# EAGLE design button_arduino (EAGLE 8.7.0)
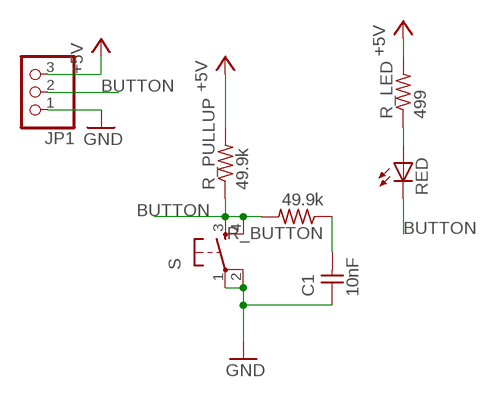
[diagram p0: schematic, sheet 1]

## Parts
C1  10nF  CAP-UNPOLARIZEDFAB  [C1206FAB]
JP1  PINHD-1X3  [1X03]
R_BUTTON  49.9k  RES-US1206FAB  [R1206FAB]
R_LED  499  RES-US1206FAB  [R1206FAB]
R_PULLUP  49.9k  RES-US1206FAB  [R1206FAB]
RED  LEDFAB1206  [LED1206FAB]
S  6MM_SWITCH6MM_SWITCH  [6MM_SWITCH]

## Nets
+5V: JP1.3 R_LED.2 R_PULLUP.2
BUTTON: JP1.2 R_BUTTON.2 R_PULLUP.1 RED.2(C) S.3(S) S.4(S1)
GND: C1.1 JP1.1 S.1(P) S.2(P1)
N$2: R_LED.1 RED.1(A)
N$4: C1.2 R_BUTTON.1

## Library data of the parts
C1 = fab:CAP-UNPOLARIZED
JP1 = pinhead:PINHD-1X3: PIN HEADER
R_BUTTON R_LED R_PULLUP = fab:RES-US: Resistor (US Symbol) Variants with postfix FAB are widened to allow the routing of internal traces
RED = fab:LED: LED
S = fab:6MM_SWITCH: OMRON SWITCH

## Board
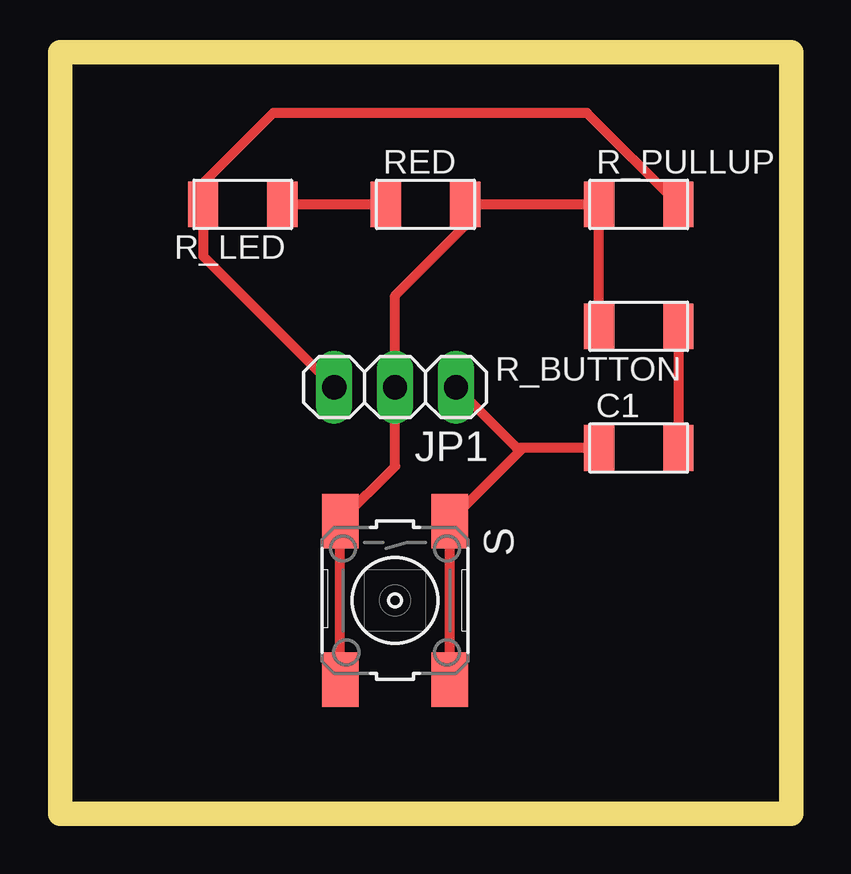
[diagram p1: board, top side]

Size 30.46 x 31.42 mm. Coordinates in mm from the lower left corner, seen from the top.
Outline: 0,0 30.46,0 30.46,31.42 0,31.42 0,0
Copper layers (1*16): Top 0.035mm / dielectric 1.5mm / Bottom 0.035mm
Design rules "default": minimum track width 6mil, minimum drill 0.35mm, track to track 6mil, track to pad 6mil, pad to pad 6mil, via to via 6mil, smd to smd 6mil, copper to edge 40mil, drill to drill 6mil, minimum pad ring 10mil, minimum via ring 8mil, stop-mask expansion 4mil, vias tented up to drill 0mil, thermal gap 10mil
Milling: 4 lines

### Footprints (pad centres in the part's own frame; a part is rotated, then mirrored left to right if it is on the bottom)
C1206FAB = smd 1.27 x 1.905: 1 -1.651,0; 2 1.651,0
1X03 = drill 1.016 long: 1 -2.54,0; 2 0,0; 3 2.54,0
R1206FAB = smd 1.27 x 1.905: 1 -1.651,0; 2 1.651,0
LED1206FAB = smd 1.27 x 1.905: 1 -1.651,0; 2 1.651,0
6MM_SWITCH = smd 2.286 x 1.524: 1 -3.302,2.286; 2 3.302,2.286; 3 -3.302,-2.286; 4 3.302,-2.286

### Placement (x,y rotation side)
C1  24.13,15.24 0 top
JP1  13.97,17.78 180 top
R_BUTTON  24.13,20.32 180 top
R_LED  7.62,25.4 180 top
R_PULLUP  24.13,25.4 0 top
RED  15.24,25.4 0 top
S  13.97,8.89 270 top

### Tracks (layer width: path | path; a pad name or v marks a point on that pad's centre or on a via)
+5V
  Top 0.406: 25.4,25.78 R_PULLUP.2 21.97,29.21 8.89,29.21 5.97,26.29 R_LED.2 5.97,23.24 JP1.3
BUTTON
  Top 0.406: R_BUTTON.2 R_PULLUP.1 RED.2 16.89,24.51 13.97,21.59 JP1.2 13.97,14.48 S.3 S.4
GND
  Top 0.406: C1.1 19.3,15.24 | 19.3,15.24 S.1 S.2 | 19.3,15.24 19.05,15.24 JP1.1
N$2
  Top 0.406: R_LED.1 RED.1
N$4
  Top 0.406: R_BUTTON.1 C1.2